# EAGLE design bt-snes-aa-ncp1402-attiny25-isp (EAGLE 6.1)
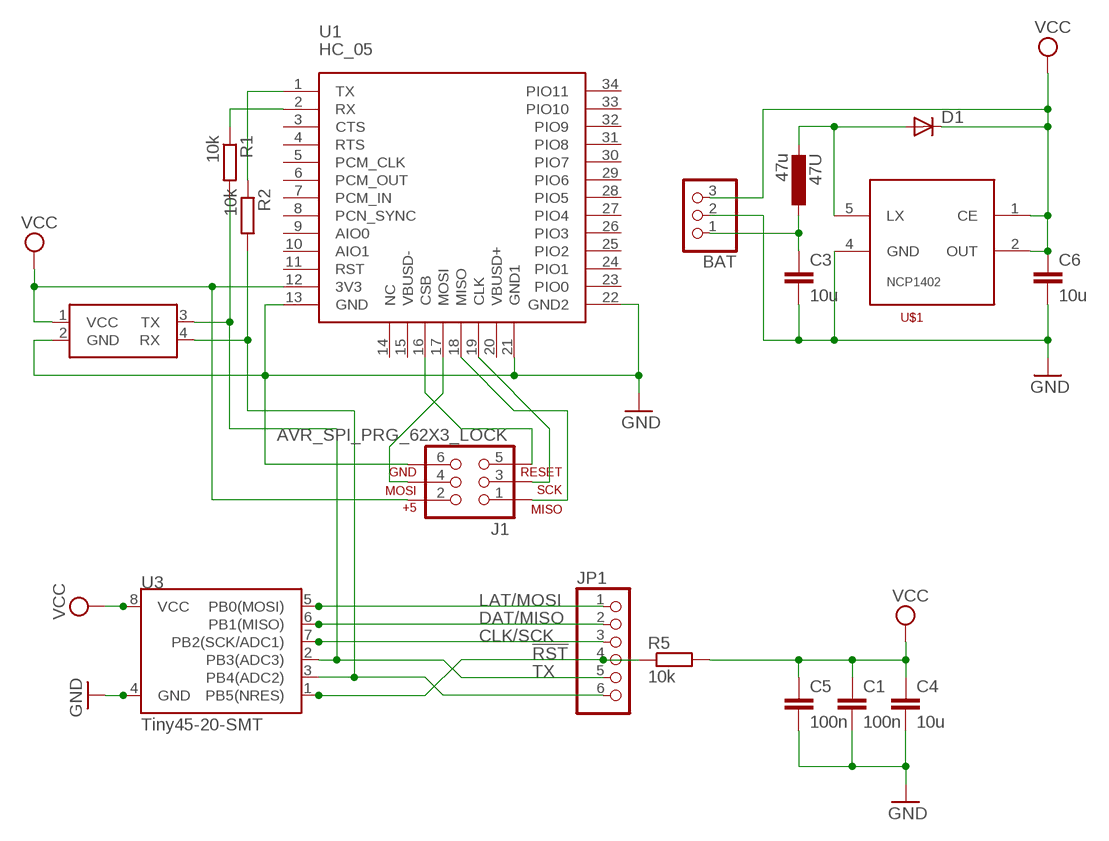
[diagram p0: schematic, sheet 1]

## Parts
47U  47u  L-EUL1210  [C1210]
BAT  PINHD-1X3  [1X03]
C1  100n  C-EUC0805K  [C0805K]
C3  10u  C-EUC0805K  [C0805K]
C4  10u  C-EUC0805K  [C0805K]
C5  100n  C-EUC0805K  [C0805K]
C6  10u  C-EUC0805K  [C0805K]
D1  DIODE-SOD80C  [SOD80C]
J1  AVR_SPI_PRG_62X3_LOCK  [2X3_LOCK]
JP1  PINHD-1X6  [1X06]
R1  10k  R-EU_M0805  [M0805]
R2  10k  R-EU_M0805  [M0805]
R5  10k  R-EU_M0805  [M0805]
U1  HC_05  [BLUETOOTH_SMD]
U3  Tiny45-20-SMT  ATTINY45TINY45-20-SMT  [SO08-EIAJ]
U$1  NCP1402-SOT23-5  [SOT23-5]
U$2  UART_CONN  [UART_CONN_LOCK]

## Nets
!RST: JP1.4 R5.1 U3.1(PB5(NRES))
CLK/SCK: JP1.3 U3.7(PB2(SCK/ADC1))
DAT/MISO: JP1.2 U3.6(PB1(MISO))
GND: BAT.2 C1.2 C3.2 C4.2 C5.2 C6.2 J1.6 U1.13(GND) U1.21(GND1) U1.22(GND2) U3.4(GND) U$1.4(GND) U$2.2(GND)
LAT/MOSI: JP1.1 U3.5(PB0(MOSI))
N$1: JP1.6 R2.2 U3.3(PB4(ADC2)) U$2.4(RX)
N$2: R1.1 U1.2(RX)
N$5: R2.1 U1.1(TX)
N$6: J1.4 U1.17(MOSI)
N$7: J1.5 U1.16(CSB)
N$8: J1.3 U1.19(CLK)
N$9: J1.1 U1.18(MISO)
N$13: 47U.1 BAT.1 C3.1
N$14: 47U.2 D1.A U$1.5(LX)
TX: JP1.5 R1.2 U3.2(PB3(ADC3)) U$2.3(TX)
VCC: BAT.3 C1.1 C4.1 C5.1 C6.1 D1.C J1.2 R5.2 U1.12(3V3) U3.8(VCC) U$1.1(CE) U$1.2(OUT) U$2.1(VCC)
Unconnected: U1.3(CTS) U1.4(RTS) U1.5(PCM_CLK) U1.6(PCM_OUT) U1.7(PCM_IN) U1.8(PCN_SYNC) U1.9(AIO0) U1.10(AIO1) U1.11(RST) U1.14(NC) U1.15(VBUSD-) U1.20(VBUSD+) U1.23(PIO0) U1.24(PIO1) U1.25(PIO2) U1.26(PIO3) U1.27(PIO4) U1.28(PIO5) U1.29(PIO6) U1.30(PIO7) U1.31(PIO8) U1.32(PIO9) U1.33(PIO10) U1.34(PIO11)

## Library data of the parts
47U = _MY_OWN_LIB:L-EU: INDUCTOR, European symbol
BAT = pinhead:PINHD-1X3: PIN HEADER
C1 C3-C6 = rcl:C-EU: CAPACITOR, European symbol
D1 = diode:DIODE-: DIODE
J1 = SparkFun-Connectors:AVR_SPI_PRG_6: AVR ISP 6 Pin This is the reduced ISP connector for AVR programming. Common on Arduino. This footprint will take up less PCB space and can be used with a 10-pin to 6-pin adapter such as SKU: BOB-08508 **Special note about "TEST_POINT" package. The stop mask is on the top side, so if you want your programming test points to be on the bottom of your board, make sure to place this package on the bottom side of the board. This also ensure that the orientation to program from the bottom side will be correct.
JP1 = pinhead:PINHD-1X6: PIN HEADER
R1 R2 R5 = rcl:R-EU_: RESISTOR, European symbol
U1 = SerialPortBluetooth:HC_05
U3 = SparkFun-DigitalIC:ATTINY45: Atmel 8-pin 2/4/8kB flash uC; PROD_ID: IC-08922
U$1 = _MY_OWN_LIB:NCP1402
U$2 = _MY_OWN_LIB:UART_CONN

## Board
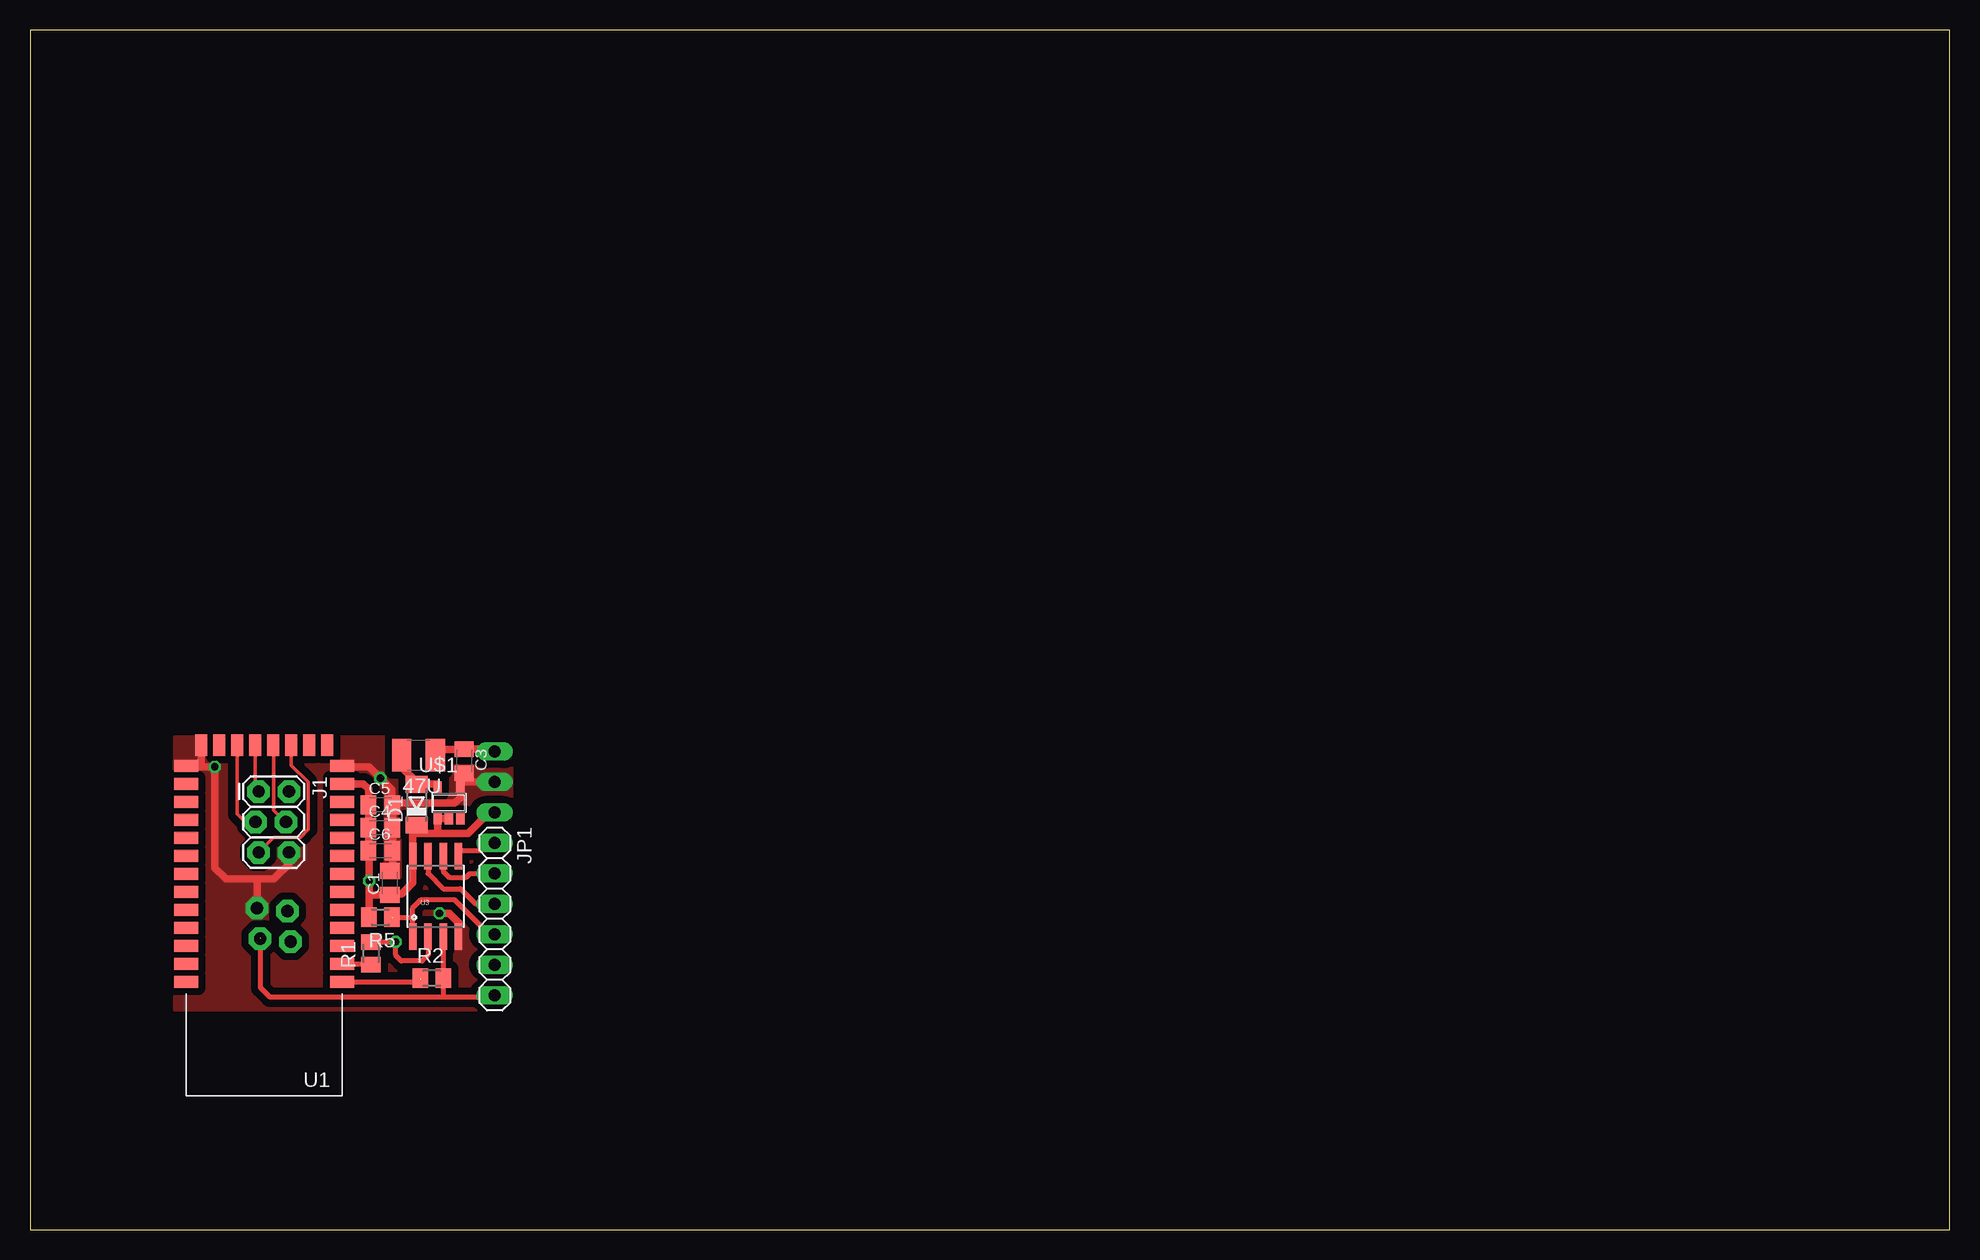
[diagram p1: board, top side]
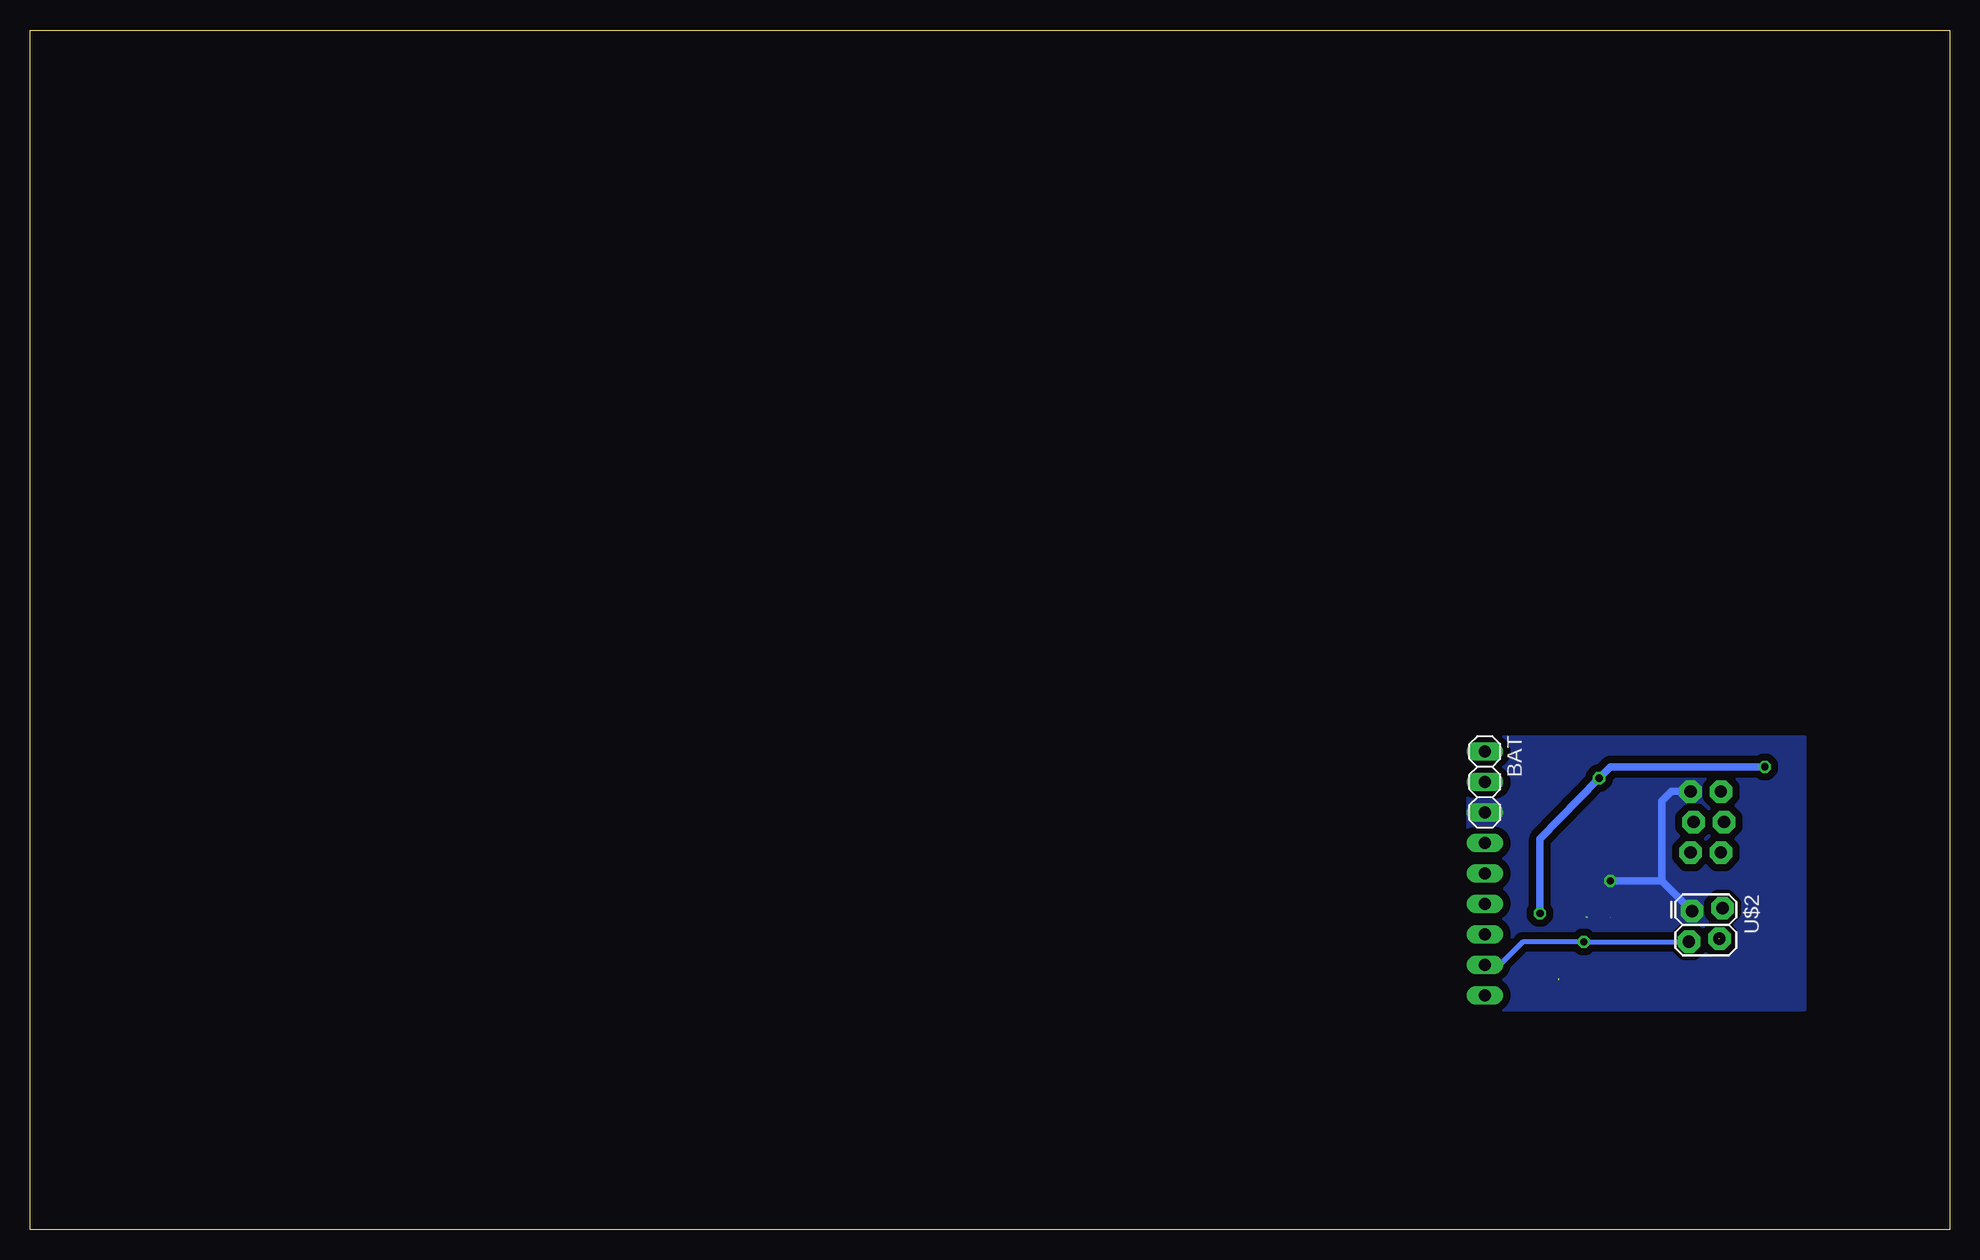
[diagram p2: board, bottom side, seen from below]

Size 160 x 100 mm. Coordinates in mm from the lower left corner, seen from the top.
Outline: 0,0 160,0 160,100 0,100 0,0
Copper layers (1*16): Top 0.035mm / dielectric 1.5mm / Bottom 0.035mm
Design rules: minimum track width 10mil, minimum drill 24mil, track to track 8mil, track to pad 8mil, pad to pad 8mil, via to via 8mil, smd to smd 8mil, copper to edge 40mil, drill to drill 8mil, minimum pad ring 10mil, minimum via ring 8mil, stop-mask expansion 4mil, vias tented up to drill 0mil, thermal gap 10mil

### Footprints (pad centres in the part's own frame; a part is rotated, then mirrored left to right if it is on the bottom)
C1210 = smd 1.6 x 2.7: 1 -1.4,0; 2 1.4,0
1X03 = drill 1.016 long: 1 -2.54,0; 2 0,0; 3 2.54,0
C0805K = smd 1.3 x 1.6: 1 -1,0; 2 1,0
SOD80C = smd 1.4 x 1.8: A 1.7,0; C -1.7,0
2X3_LOCK = drill 1.016 pad 1.88 octagon: 1 0,0; 2 0,2.54; 3 2.54,-0.254; 4 2.54,2.286; 5 5.08,0; 6 5.08,2.54
1X06 = drill 1.016 long: 1 -6.35,0; 2 -3.81,0; 3 -1.27,0; 4 1.27,0; 5 3.81,0; 6 6.35,0
M0805 = smd 1.3 x 1.6: 1 -0.95,0; 2 0.95,0
BLUETOOTH_SMD = smd 2 x 1: 1 0,0; 2 0,-1.5; 3 0,-3; 4 0,-4.5; 5 0,-6; 6 0,-7.5; 7 0,-9; 8 0,-10.5; 9 0,-12; 10 0,-13.5; 11 0,-15; 12 0,-16.5; 13 0,-18; 22 13,-18; 23 13,-16.5; 24 13,-15; 25 13,-13.5; 26 13,-12; 27 13,-10.5; 28 13,-9; 29 13,-7.5; 30 13,-6; 31 13,-4.5; 32 13,-3; 33 13,-1.5; 34 13,0 | smd 1 x 1.8: 14 1.25,-19.75; 15 2.75,-19.75; 16 4.25,-19.75; 17 5.75,-19.75; 18 7.25,-19.75; 19 8.75,-19.75; 20 10.25,-19.75; 21 11.75,-19.75
SO08-EIAJ = smd 0.61 x 2.21: 1 -1.905,-3.378; 2 -0.635,-3.378; 3 0.635,-3.378; 4 1.905,-3.378; 5 1.905,3.353; 6 0.635,3.353; 7 -0.635,3.353; 8 -1.905,3.353
SOT23-5 = smd 0.69 x 0.99: 1 -0.95,-1.29; 2 0,-1.29; 3 0.95,-1.29; 4 0.95,1.3; 5 -0.95,1.3
UART_CONN_LOCK = drill 1.016 pad 1.88 octagon: 1 -1.143,-1.143; 2 -1.397,1.397; 3 1.397,-1.397; 4 1.143,1.143

### Placement (x,y rotation side)
47U  32.38,39.53 180 top
BAT  38.73,37.31 270 bottom
C1  30,28.89 90 top
C3  36.2,39.05 270 top
C4  29.21,33.5 0 top
C5  29.21,35.4 0 top
C6  29.21,31.59 0 top
D1  32.23,35.4 90 top
J1  19.05,36.51 270 top
JP1  38.73,25.88 270 top
R1  28.42,23.02 90 top
R2  33.5,20.95 0 top
R5  29.21,26.04 180 top
U1  26.04,20.64 180 top
U3  33.81,27.78 0 top
U$1  34.92,35.56 0 top
U$2  20.32,25.4 270 bottom

### Tracks (layer width: path | path; a pad name or v marks a point on that pad's centre or on a via)
!RST  (1 unrouted)
  Top 0.406: 30.32,26.04 31.91,26.04 | U3.1 31.91,26.04 | JP1.4 38.26,24.61 35.4,27.46 32.54,27.46 31.91,26.83 31.91,26.04
CLK/SCK
  Top 0.406: U3.7 33.18,29.69 34.45,28.42 35.88,28.42 37.15,27.15 JP1.3
DAT/MISO
  Top 0.406: U3.6 34.45,29.84 34.92,29.37 36.35,29.37 36.67,29.69 JP1.2
GND  (via drill 0.6 pad 0.25)
  Top 0.406: C6.2 30.21,35.35 30.16,35.4 | U$1.4 | 30.37,35.56 C5.2 | 30.21,29.89 30,29.69
  Top 0.61: C5.2 C4.2 C6.2 30.21,29.89 | 30.16,35.4 30.16,36.67 v29.21,37.62 28.26,38.58 26.04,38.58 U1.13 | 30.37,35.56 35.4,35.56 35.88,36.04 35.88,36.83 U$1.4 35.88,37.31 | 35.88,37.31 35.88,38.05 C3.2 | BAT.2 35.88,37.31 | 14.29,38.58 13.1,38.58 U1.22 | 14.29,38.58 v15.4,38.58 15.4,30.16 16.35,29.21 20.32,29.21 21.59,30.48 J1.6 | 14.29,38.58 U1.21 | v34.13,26.35 34.92,26.35 35.72,25.56 U3.4 | U$2.2 18.92,29.02 18.89,29.05
  Bottom 0.61: v34.13,26.35 34.13,32.54 v29.21,37.62 28.26,38.58 v15.4,38.58
  pour Top (isolate 0.61, no thermals): 12.06,41.12 40.16,41.12 40.16,18.26 12.06,18.26
LAT/MOSI
  Top 0.406: U3.5 35.72,31.59 37.62,31.59 38.26,32.23 JP1.1
N$1  (1 unrouted)
  Top 0.406: U3.3 34.45,20.8 | 34.45,20.8 R2.2 | JP1.6 37.47,19.53 37.31,19.37 34.45,19.37 | 34.45,19.37 20,19.37 19.21,20.16 19.21,24.29 | 34.45,20.8 34.45,19.37
N$2
  Top 0.406: U1.2 28.19,22.14 R1.1
N$5  (1 unrouted)
  Top 0.406: U1.1 32.38,20.64 32.54,20.8
N$6
  Top 0.305: J1.4 21.27,33.97 20.32,34.92 20.32,40.01 20.29,40.04 U1.17
N$7
  Top 0.305: U1.16 21.79,38.7 23.18,37.31 23.18,33.34 22.54,32.7 20.32,32.7 J1.5
N$8
  Top 0.305: U1.19 17.29,34.63 17.94,33.97 J1.3
N$9
  Top 0.305: U1.18 18.79,36.78 J1.1
N$13
  Top 0.406: 47U.1 33.47,39.66 33.81,40.01 | 35.83,40.01 C3.1
  Top 0.61: 33.81,40.01 35.83,40.01 | C3.1 38.69,40.05 BAT.1
N$14
  Top 0.406: 32.59,37.15 D1.A
  Top 0.61: 32.59,37.15 32.23,37.15 | 33.94,36.86 33.97,36.83 | 32.31,37.23 32.38,37.15 33.97,37.15 33.94,36.86 | 32.31,37.23 30.96,38.58 30.98,38.6 47U.2 | U$1.5 33.94,36.86 | D1.A 32.23,37.15 | 32.23,37.15 32.31,37.23
TX  (via drill 0.6 pad 0.25)
  Top 0.406: U3.2 33.18,22.86 32.7,22.38 30.96,22.38 30.48,22.86 v30.48,23.97 30.16,23.97 R1.2
  Bottom 0.406: U$2.3 22.23,23.97 v30.48,23.97 35.56,23.97 37.47,22.07 JP1.5
VCC  (via drill 0.6 pad 0.25)  (1 unrouted)
  Top 0.406: 33.07,33.02 D1.C | 33.98,33.02 34.29,33.02 | 28.26,31.54 C6.1 | 30.08,27.97 C1.1
  Top 0.61: 34.29,33.02 33.07,33.02 31.91,33.02 U3.8 31.91,28.89 30.98,27.97 30.08,27.97 | U$1.2 U$1.1 33.98,33.02 36.52,33.02 38.26,34.77 BAT.3 | U1.12 27.79,37.14 28.21,36.72 C5.1 C4.1 C6.1 | 28.26,31.54 v28.26,29.05 28.26,27.78 | 28.26,27.78 R5.2 | C1.1 28.37,27.89 28.26,27.78
  Bottom 0.61: U$2.1 23.97,29.05 | 23.97,29.05 v28.26,29.05 | J1.2 23.18,36.51 23.97,35.72 23.97,29.05
  pour Bottom (isolate 0.61, no thermals): 12.06,18.26 40.16,18.26 40.16,41.12 12.06,41.12